# EasyEDA Pro project LisaFPGA Rev 2 EasyEDA Project.epro, board Twiggy Breakout PCB
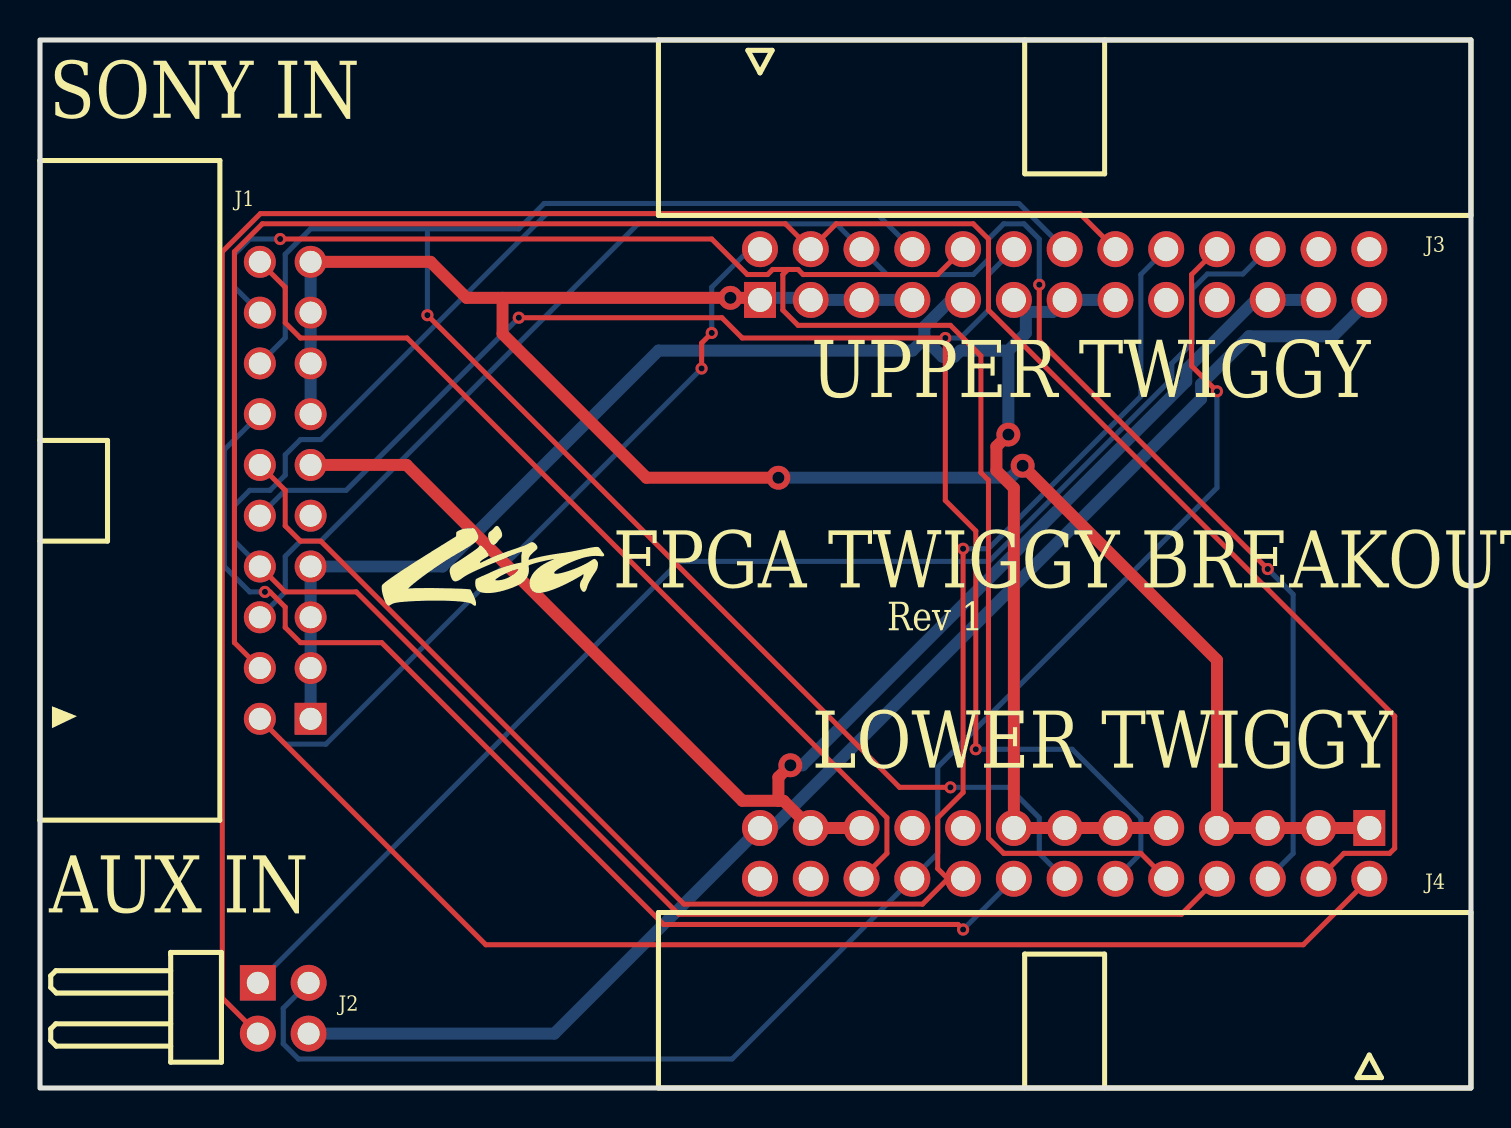
[diagram p9: board, top side]
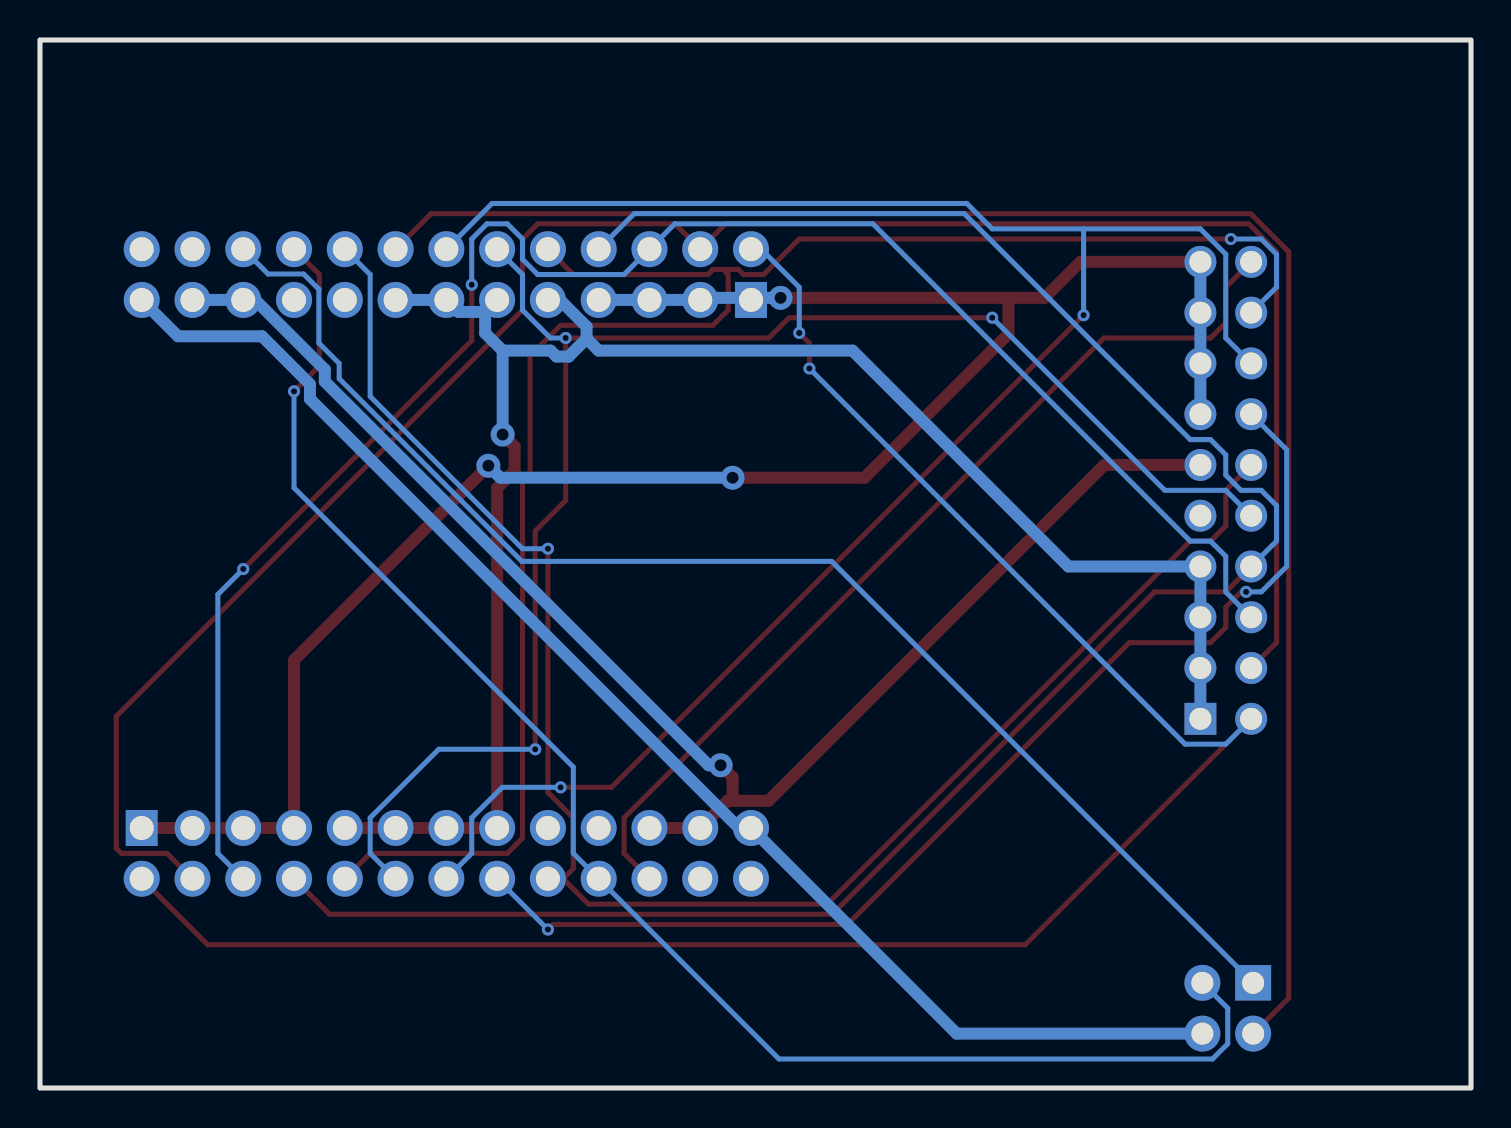
[diagram p10: board, bottom side, seen from below]

Outline 71.58 x 52.43 mm; copper layers: Top Layer, Bottom Layer. Coordinates in mm from the lower left corner of the outline.
Outline path: rectangle 0,52.43 71.58,0
Stack: Top Layer 0.035mm / Dielectric1 1.51mm FR4 er 4.5 / Bottom Layer 0.035mm

## Design rules (mm)
template: Custom Config
spacing copperThickness1oz (default): track to track 0.102, other pairs 0.152 to 0.3
spacing copperThickness2oz: track to track 0.203, other pairs 0.152 to 0.3
track width copperThickness1oz (default): min 0.127, default 0.254, max 2.54
track width copperThickness2oz: min 0.203, default 0.254, max 2.54
track width POWER: min 0.6, default 0.6, max 2.54
differential pair differentialPair (default): width min 0.127, default 0.254, max 2.54; gap min 0.152, default 0.152
via viaSize (default): diameter min 0.5, default 0.61, max 10; hole min 0.3, default 0.305, max 6.3
via POWER: diameter min 0.5, default 1.2, max 10; hole min 0.3, default 0.6, max 6.3
net 12V uses POWER
net 5V uses POWER
net GND uses POWER
net -5V uses POWER

## Placement (name value [footprint] x y rotation side)
J1  X9555WR-2x10-6TV01  [CONN-TH_20P-P2.54_XKB_X9555WR-2X10-6TV01]  12.27 29.9 270 top
J2  PZ254R-12-4P  [HDR-TH_4P-P2.54-H-M-R2-C2-S2.54]  12.17 3.99 270 top
J3  2.54-2*13P弯简牛  [IDC-TH_26P-P2.54_BOOMELE-2X13P-2.54MM-H]  51.26 40.69 180 top
J4  2.54-2*13P弯简牛  [IDC-TH_26P-P2.54_BOOMELE-2X13P-2.54MM-H]  51.26 11.74 0 top

## Footprints (pads in the part's own frame, mm; a bottom-side part is the same pattern mirrored in y, then rotated)
CONN-TH_20P-P2.54_XKB_X9555WR-2X10-6TV01
  rect 1.6x1.6 hole 1.1: 1(11.43,1.27)
  round 1.6 hole 1.1: 2(11.43,-1.27) 3(8.89,1.27) 4(8.89,-1.27) 5(6.35,1.27) 6(6.35,-1.27) 7(3.81,1.27) 8(3.81,-1.27) 9(1.27,1.27) 10(1.27,-1.27) 11(-1.27,1.27) 12(-1.27,-1.27) 13(-3.81,1.27) 14(-3.81,-1.27) 15(-6.35,1.27) 16(-6.35,-1.27) 17(-8.89,1.27) 18(-8.89,-1.27) 19(-11.43,1.27) 20(-11.43,-1.27)
HDR-TH_4P-P2.54-H-M-R2-C2-S2.54
  rect 1.778x1.8 hole 1.1: 1(-1.27,-1.27)
  round 1.8 hole 1.1: 2(-1.27,1.27) 3(1.27,-1.27) 4(1.27,1.27)
IDC-TH_26P-P2.54_BOOMELE-2X13P-2.54MM-H
  rect 1.6x1.8 hole 1.2: 1(15.24,1.27)
  round 1.8 hole 1.2: 2(15.24,-1.27) 3(12.7,1.27) 4(12.7,-1.27) 5(10.16,1.27) 6(10.16,-1.27) 7(7.62,1.27) 8(7.62,-1.27) 9(5.08,1.27) 10(5.08,-1.27) 11(2.54,1.27) 12(2.54,-1.27) 13(0,1.27) 14(0,-1.27) 15(-2.54,1.27) 16(-2.54,-1.27) 17(-5.08,1.27) 18(-5.08,-1.27) 19(-7.62,1.27) 20(-7.62,-1.27) 21(-10.16,1.27) 22(-10.16,-1.27) 23(-12.7,1.27) 24(-12.7,-1.27) 25(-15.24,1.27) 26(-15.24,-1.27)

## Nets
As in the schematic.

Pads without a net: J1 9; J3 17 19 24 26; J4 17 19 24 26

## Via types
v1: diameter 1.2, hole 0.6, Top Layer to Bottom Layer, 5 vias
v2: diameter 0.61, hole 0.305, Top Layer to Bottom Layer, 14 vias

## Routing (per net, layer and track width the routed paths; a pad name or vN(x,y) marks a point on that pad's centre or on a via; arc(x,y) is an arc through that point)
5V: length 73.5
  Top Layer w0.6: J1.11 18.34,31.17 35.14,14.37 36.94,14.37 ; J4.21 J4.23 37.2,14.37 36.94,14.37 ; 36.94,14.37 36.94,15.55 v1(37.54,16.15)
  Bottom Layer w0.6: J3.23 J3.21 60.82,39.42 57.34,35.95 57.34,35.35 38.14,16.15 v1(37.54,16.15)
12V: length 100.8
  Top Layer w0.6: v1(36.94,30.53) 30.34,30.53 23.14,37.73 23.14,39.53 ; 23.14,39.53 v1(34.54,39.53) 35.91,39.53 J3.1 ; 23.14,39.53 21.34,39.53 19.54,41.33 J1.19 ; J4.1 J4.3 J4.5 J4.7 58.88,21.41 v1(49.16,31.13)
  Bottom Layer w0.6: J3.7 J3.5 J3.3 38.45,39.53 v1(34.54,39.53) ; J1.19 J1.17 J1.15 J1.13 ; v1(49.16,31.13) 48.56,30.53 v1(36.94,30.53)
-5V: length 68.7
  Bottom Layer w0.6: J3.25 64.68,37.61 60.48,37.61 58.08,35.21 58.08,34.47 36.62,13.01 J4.25 25.73,2.72 J2.4
GND: length 90.8
  Top Layer w0.6: J4.9 J4.11 J4.13 J4.15 48.72,30.02 47.84,30.89 47.84,32.09 v1(48.44,32.69)
  Bottom Layer w0.6: 44.24,37.49 44.24,38.09 45.44,39.29 46.04,39.29 J3.9 ; 44.24,37.49 43.64,36.89 30.94,36.89 20.14,26.09 J1.7 J1.5 J1.3 J1.1 ; 44.24,37.49 45.14,36.59 45.74,36.59 46.04,36.89 48.44,36.89 ; 48.44,36.89 v1(48.44,32.69) ; 48.44,36.89 49.32,37.77 49.32,38.83 ; 49.32,38.83 50.66,38.83 J3.13 J3.15 ; 49.32,38.83 J3.11
/DR0: length 86.1
  Top Layer w0.254: J3.16 52.02,43.74 11.02,43.74 9.12,41.84 9.12,4.5 J2.3
/DR1: length 57
  Top Layer w0.254: v2(46.18,7.93) 45.92,8.18 31.19,8.18 17.09,22.28 13.03,22.28 12.27,23.04 12.27,24.06 11.51,24.82 v2(11.25,24.82)
  Bottom Layer w0.254: v2(11.25,24.82) 10.49,24.82 9.22,26.09 9.22,31.93 J1.14 ; v2(46.18,7.93) 48.72,10.47
/WRQ: length 79.6
  Top Layer w0.254: v2(46.81,16.95) 46.81,27.87 45.29,29.39 v2(45.29,37.52) 35.13,37.52 34.11,38.54 v2(23.95,38.54)
  Bottom Layer w0.254: J1.10 12.27,29.9 15.32,29.9 v2(23.95,38.54) ; v2(45.29,37.52) 46.05,37.52 47.45,38.92 47.45,40.69 J3.12 ; v2(46.81,16.95) 51.64,16.95 55.07,13.52 55.07,11.74 53.8,10.47
HDS: length 83
  Top Layer w0.254: 45.42,10.47 44.91,10.98 44.91,13.52 46.18,14.79 v2(46.18,26.98) ; 45.42,10.47 44.14,9.2 32.21,9.2 14.05,27.36 13.03,27.36 12.27,28.12 12.27,29.9 J1.12 ; 45.42,10.47 46.18,10.47
  Bottom Layer w0.254: J3.18 55.07,40.69 55.07,34.6 47.45,26.98 v2(46.18,26.98)
MT0: length 67.7
  Bottom Layer w0.254: J2.1 31.98,26.34 47.47,26.34 56.62,35.49 56.62,36.25 57.63,37.27 57.63,39.96 58.4,40.72 60.17,40.72 J3.22
MT1: length 47.5
  Top Layer w0.254: J1.20 12.27,40.06 12.27,38.28 13.03,37.52 18.36,37.52 42.37,13.52 42.37,11.74 41.1,10.47
PH0: length 99.4
  Top Layer w0.254: J1.2 22.3,7.17 63.2,7.17 66.5,10.47 ; v2(33.1,36) 33.1,37.27 v2(33.6,37.77)
  Bottom Layer w0.254: v2(33.6,37.77) 33.6,40.06 35.38,41.84 35.89,41.84 J3.2 ; v2(33.1,36) 14.3,17.2 12.27,17.2 J1.2
PH1: length 104.4
  Top Layer w0.254: J1.4 9.73,22.28 9.73,41.84 11.12,43.23 37.29,43.23 J3.4 39.83,43.23 46.68,43.23 47.45,42.47 47.45,38.92 67.77,18.6 67.77,11.99 67.51,11.74 65.23,11.74 63.96,10.47
PH2: length 89
  Top Layer w0.254: v2(49.99,40.19) 49.99,37.39 v2(61.42,25.96)
  Bottom Layer w0.254: J1.6 12.27,24.82 12.27,26.6 13.03,27.36 14.05,27.36 29.92,43.23 39.83,43.23 J3.6 42.37,40.69 46.68,40.69 47.45,41.46 47.45,42.47 48.21,43.23 49.23,43.23 49.99,42.47 v2(49.99,40.19) ; 61.42,10.47 62.69,11.74 62.69,24.69 v2(61.42,25.96)
PH3: length 100.7
  Top Layer w0.254: 58.88,10.47 57.1,8.69 31.95,8.69 15.82,24.82 12.27,24.82 J1.8
  Bottom Layer w0.254: J3.8 41.86,43.74 25.35,43.74 14.05,32.44 13.03,32.44 12.27,31.68 12.27,30.66 11.51,29.9 10.49,29.9 9.73,29.14 9.73,27.36 J1.8
RDA: length 95.9
  Top Layer w0.254: v2(19.38,38.66) 43,15.04 v2(45.54,15.04)
  Bottom Layer w0.254: 19.38,42.98 23.95,42.98 25.22,44.25 48.97,44.25 J3.14 ; 19.38,42.98 v2(19.38,38.66) ; 19.38,42.98 13.54,42.98 12.27,41.71 12.27,37.52 J1.16 ; 51.26,10.47 49.99,11.74 49.99,13.52 48.46,15.04 v2(45.54,15.04)
SNS: length 78
  Top Layer w0.254: v2(58.88,34.85) 57.61,36.12 57.61,40.69 J3.20
  Bottom Layer w0.254: v2(58.88,34.85) 58.88,30.03 44.91,16.06 44.91,11.74 34.62,1.45 12.93,1.45 12.17,2.21 12.17,3.99 J2.2
WRD: length 88.7
  Top Layer w0.254: 37.41,40.95 37.16,40.69 37.16,38.92 37.92,38.16 45.54,38.16 47.07,36.63 47.07,30.79 47.45,30.41 47.45,12.5 48.21,11.74 55.07,11.74 56.34,10.47 ; 37.41,40.95 37.92,40.95 38.18,40.69 44.91,40.69 J3.10 ; 37.41,40.95 36.65,40.95 36.4,40.69 35.38,40.69 33.6,42.47 v2(12.01,42.47)
  Bottom Layer w0.254: J1.18 9.73,40.06 9.73,41.71 10.49,42.47 v2(12.01,42.47)

## Text on the board
Top Silkscreen Layer: Rev 1 | SONY IN | AUX IN | FPGA TWIGGY BREAKOUT | UPPER TWIGGY | LOWER TWIGGY
